# Altium schematic sheet Power_LEDs.SchDoc: Power LEDs
size A4; Engineer: Anthony Grana
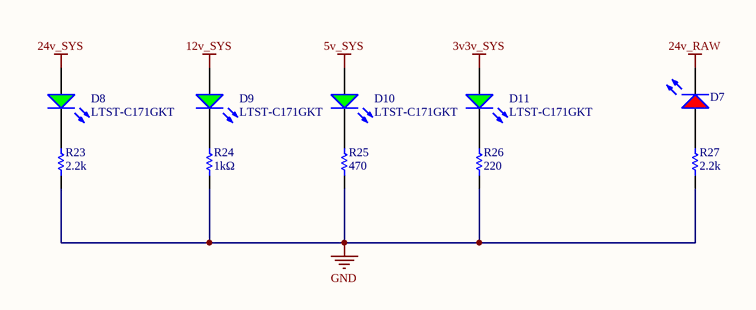
[diagram p0: Power_LEDs.SchDoc]

## Parts
D7  Lite-On LTST-C170CKT  [PCB-divvmvv5iwnkp0y4rvhb-1]  (value not drawn)
D8  Manufacturer Part Number: LTST-C171GKT  [PCB-divvmvv5iwnkp0y4rvhb-1]  (hidden comment: SYM-3aeff3ed7c74e528-12)
D9  Manufacturer Part Number: LTST-C171GKT  [PCB-divvmvv5iwnkp0y4rvhb-1]  (hidden comment: SYM-3aeff3ed7c74e528-12)
D10  Manufacturer Part Number: LTST-C171GKT  [PCB-divvmvv5iwnkp0y4rvhb-1]  (hidden comment: SYM-3aeff3ed7c74e528-12)
D11  Manufacturer Part Number: LTST-C171GKT  [PCB-divvmvv5iwnkp0y4rvhb-1]  (hidden comment: SYM-3aeff3ed7c74e528-12)
R23  Resistance: 2.2k  [RESC1508X06N]  (hidden comment: Res1)
R24  Resistance: 1kΩ  [RESC1508X06N]  (hidden comment: Res1)
R25  Resistance: 470  [RESC1508X06N]  (hidden comment: Res1)
R26  Resistance: 220  [RESC1508X06N]  (hidden comment: Res1)
R27  Resistance: 2.2k  [RESC1508X06N]  (hidden comment: Res1)

## Nets
3v3v_SYS: D11.2(A)
5v_SYS: D10.2(A)
12v_SYS: D9.2(A)
24v_RAW: D7.1(C)
24v_SYS: D8.2(A)
GND: R23.2 R24.2 R25.2 R26.2 R27.2
NetD7_2: D7.2(A) R27.1
NetD8_1: D8.1(C) R23.1
NetD9_1: D9.1(C) R24.1
NetD10_1: D10.1(C) R25.1
NetD11_1: D11.1(C) R26.1

## Notes on the sheet
- Title
- Size:
- Date:
- A4
- Engineer:
- Time:
- Sheet
- Revision:
- of
- File:

## Library data of the parts
D7 = CMP-b6f07ff2f0206937-3: LED; SMD; 0805; red; 2.8-10mcd; 2x1.25x1.1mm; 130°; 1.8÷2.4V; 10mA
D8-D11 = CMP-1544858-16: LED; SMD; 0805; green; 1.8-6mcd; 2x1.25x0.8mm; 130°; 2.1÷2.4V; 10mA; Wavelength: 585 nm; Forward Voltage: 2.10 V; Size-Height: 800 µm; Octopart URL: http://octopart.com/ltst-c171gkt-lite-on-549885; Viewing Angle: 130 °; Size-Length: 2.00 mm
R23-R27 = CMP-49e581ca47bd9622-1: RMCF Series 0603 0.1 W 2.2 kOhm ±1 % ±100 ppm/°C SMT Thick Film Chip Resistor; Manufacturer Part Number: RMCF0603FT2K20; RoHS: Compliant